# Altium schematic sheet Connector.SchDoc
size A4
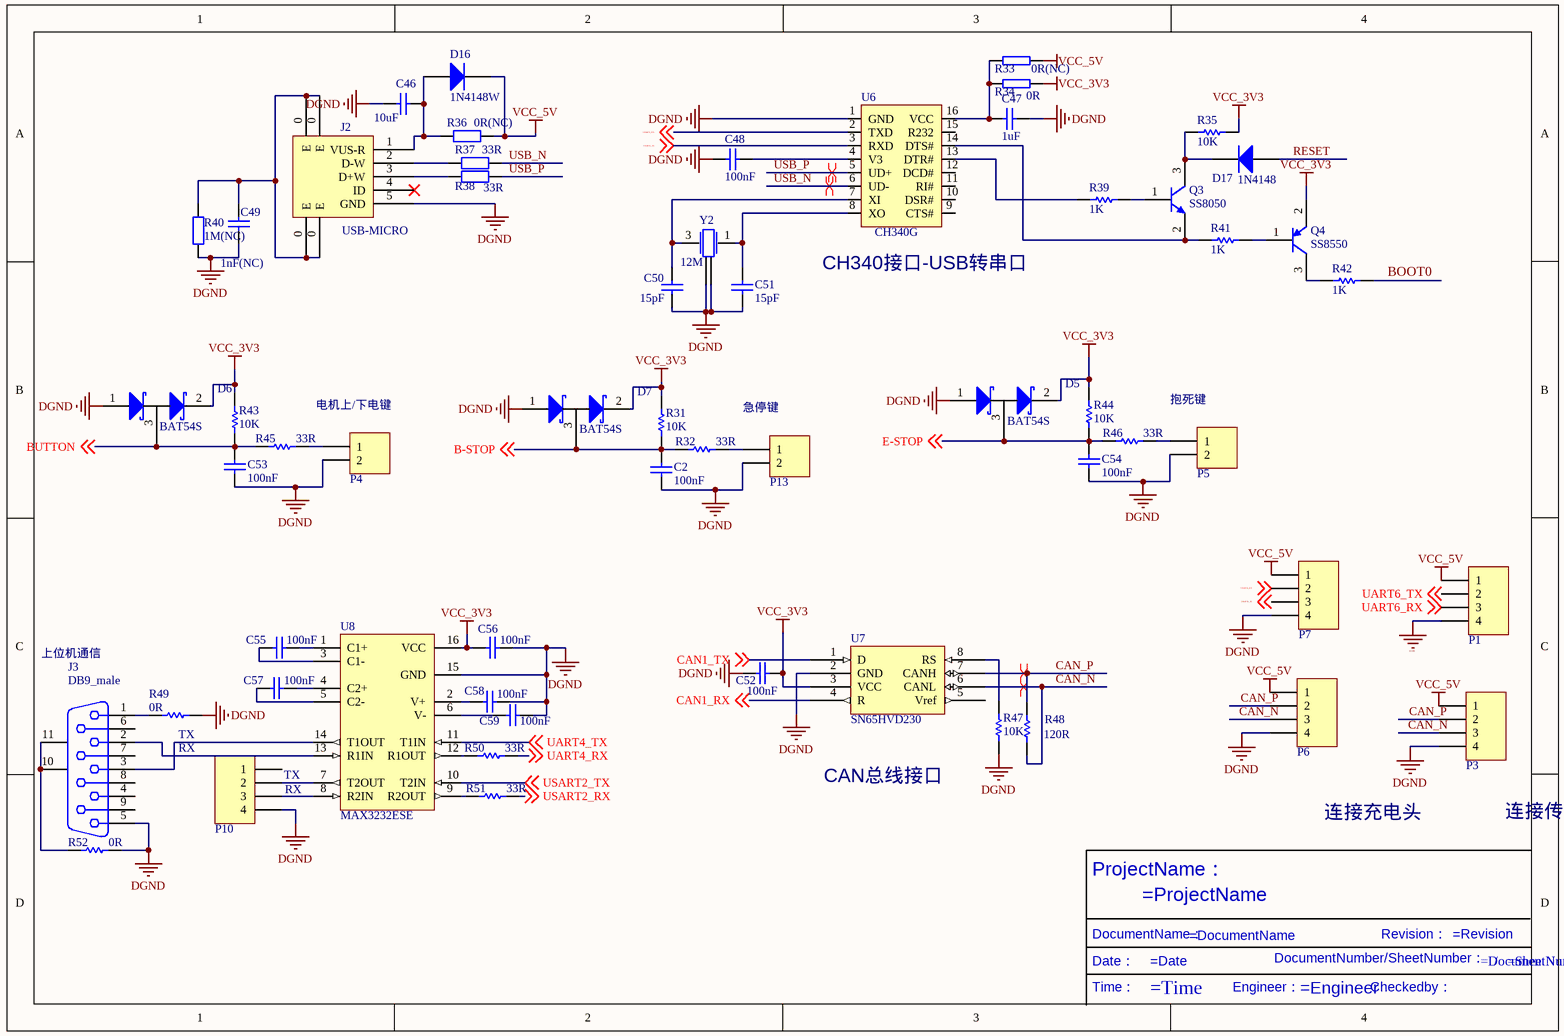
[diagram p0: Connector.SchDoc]

## Parts
C2  value 100nF  [C-RAD-0805]  (hidden comment: 100nF/±10%/50Vdc)
C46  value 10uF  [C-RAD-0805]  (hidden comment: 10uF/±10%/50Vdc)
C47  value 1uF  [C-RAD-0805]  (hidden comment: 1uF/±10%/50Vdc)
C48  value 100nF  [C-RAD-0805]  (hidden comment: 100nF/±10%/50Vdc)
C49  value 1nF(NC)  [C-RAD-0805]  (hidden comment: Cap)
C50  value 15pF  [C-RAD-0805]  (hidden comment: 15pF/±10%/50Vdc)
C51  value 15pF  [C-RAD-0805]  (hidden comment: 15pF/±10%/50Vdc)
C52  value 100nF  [C-RAD-0805]  (hidden comment: 100nF/±10%/50Vdc)
C53  value 100nF  [C-RAD-0805]  (hidden comment: 100nF/±10%/50Vdc)
C54  value 100nF  [C-RAD-0805]  (hidden comment: 100nF/±10%/50Vdc)
C55  value 100nF  [C-RAD-0805]  (hidden comment: 100nF/±10%/50Vdc)
C56  value 100nF  [C-RAD-0805]  (hidden comment: 100nF/±10%/50Vdc)
C57  value 100nF  [C-RAD-0805]  (hidden comment: 100nF/±10%/50Vdc)
C58  value 100nF  [C-RAD-0805]  (hidden comment: 100nF/±10%/50Vdc)
C59  value 100nF  [C-RAD-0805]  (hidden comment: 100nF/±10%/50Vdc)
D5  BAT54S  [SOT-23]
D6  BAT54S  [SOT-23]
D7  BAT54S  [SOT-23]
D16  1N4148W  [DIODE-1206]
D17  value 1N4148  [DIODE-1206]  (hidden comment: 1N4148W)
J2  USB-MICRO  [USB-MICRO-1]
J3  DB9_male  [DB9-M]
P1  Header 4  [SM04B-PBV]  (value not drawn)
P3  Header 4  [SM04B-PBV]  (value not drawn)
P4  Header 2  [MOLEX-2P]  (value not drawn)
P5  Header 2  [MOLEX-2P]  (value not drawn)
P6  Header 4  [SM04B-PBV]  (value not drawn)
P7  Header 4  [SM04B-PBV]  (value not drawn)
P10  Header 4  [SM04B-PBV]  (value not drawn)
P13  Header 2  [MOLEX-2P]  (value not drawn)
Q3  SS8050  [SOT-23]
Q4  SS8550  [SOT-23]
R31  value 10K  [0805-1]  (hidden comment: 10K 5% 1/16W 0805)
R32  value 33R  [0805-1]  (hidden comment: 33R 5% 1/16W 0805)
R33  value 0R(NC)  [0805-1]  (hidden comment: 0R 5% 1/16W 0805(NC))
R34  value 0R  [0805-1]  (hidden comment: 0R 5% 1/16W 0805)
R35  value 10K  [0805-1]  (hidden comment: 10K 5% 1/16W 0805)
R36  value 0R(NC)  [0805-1]  (hidden comment: 0R 5% 1/16W 0805(NC))
R37  value 33R  [0805-1]  (hidden comment: 33R 5% 1/16W 0805)
R38  value 33R  [0805-1]  (hidden comment: 33R 5% 1/16W 0805)
R39  value 1K  [0805-1]  (hidden comment: 1K 5% 1/16W 0805)
R40  value 1M(NC)  [0805-1]  (hidden comment: 1M 5% 1/16W 0805(NC))
R41  value 1K  [0805-1]  (hidden comment: 1K 5% 1/16W 0805)
R42  value 1K  [0805-1]  (hidden comment: 1K 5% 1/16W 0805)
R43  value 10K  [0805-1]  (hidden comment: 10K 5% 1/16W 0805)
R44  value 10K  [0805-1]  (hidden comment: 10K 5% 1/16W 0805)
R45  value 33R  [0805-1]  (hidden comment: 33R 5% 1/16W 0805)
R46  value 33R  [0805-1]  (hidden comment: 33R 5% 1/16W 0805)
R47  value 10K  [0805-1]  (hidden comment: 10K 5% 1/16W 0805)
R48  value 120R  [0805-1]  (hidden comment: 120R 5% 1/16W 0805)
R49  value 0R  [0805-1]  (hidden comment: 0R 5% 1/16W 0805)
R50  value 33R  [0805-1]  (hidden comment: 33R 5% 1/16W 0805)
R51  value 33R  [0805-1]  (hidden comment: 33R 5% 1/16W 0805)
R52  value 0R  [0805-1]  (hidden comment: 0R 5% 1/16W 0805)
U6  CH340G  [SOP16]
U7  SN65HVD230  [SO8-SN65HVD230]
U8  MAX3232ESE  [SOP16]
Y2  value 12M  [EPSON-16M]  (hidden comment: XTAL-12M)

## Nets
DGND: C2.2 C46.2 C47.2 C48.2 C49.2 C50.2 C51.2 C52.1 C53.2 C54.2 C56.1 C58.1 C59.1 D5.1(A) D6.1(A) D7.1(A) J2.5(GND) J3.5 P1.4 P3.4 P4.2 P5.2 P6.4 P7.4 P10.4 P13.2 R40.1 R47.2 R49.1 R52.1 U6.1(GND) U7.2(GND) U8.15(GND) Y2.2 Y2.4
VCC_3V3: C52.2 C56.2 D5.2(K) D6.2(K) D7.2(K) Q4.2(E) R31.2 R34.1 R35.1 R43.2 R44.2 U7.3(VCC) U8.16(VCC)
VCC_5V: D16.2(K) P1.1 P3.1 P6.1 P7.1 R33.1 R36.2
B-STOP: C2.1 D7.3(AK) R31.1 R32.2 ; off-sheet B-STOP
BOOT0: R42.2
BUTTON: C53.1 D6.3(AK) R43.1 R45.2 ; off-sheet BUTTON
CAN1_RX: U7.4(R) ; off-sheet CAN1_RX
CAN1_TX: U7.1(D) ; off-sheet CAN1_TX
CAN_N: P3.3 P6.3 R48.2 U7.6(CANL)
CAN_P: P3.2 P6.2 R48.1 U7.7(CANH)
E-STOP: C54.1 D5.3(AK) R44.1 R46.2 ; off-sheet E-STOP
RESET: D17.1(A)
UART4_RX: R50.2 ; off-sheet UART4_RX
UART4_TX: U8.11(T1IN) ; off-sheet UART4_TX
UART6_RX: P1.3 ; off-sheet UART6_RX
UART6_TX: P1.2 ; off-sheet UART6_TX
USART1_RX: U6.2(TXD) ; off-sheet USART1_RX
USART1_TX: U6.3(RXD) ; off-sheet USART1_TX
USART2_RX: R51.2 ; off-sheet USART2_RX
USART2_TX: U8.10(T2IN) ; off-sheet USART2_TX
USART3_RX: P7.2 ; off-sheet USART3_RX
USART3_TX: P7.3 ; off-sheet USART3_TX
USB_N: R37.2 U6.6(UD-)
USB_P: R38.2 U6.5(UD+)
NetC46_1: C46.1 D16.1(A) J2.1(VUS-R) R36.1
NetC47_1: C47.1 R33.2 R34.2 U6.16(VCC)
NetC48_1: C48.1 U6.4(V3)
NetC49_1: C49.1 J2.0(E) R40.2
NetC50_1: C50.1 U6.7(XI) Y2.3
NetC51_1: C51.1 U6.8(XO) Y2.1
NetC55_1: C55.1 U8.1(C1+)
NetC55_2: C55.2 U8.3(C1-)
NetC57_1: C57.1 U8.4(C2+)
NetC57_2: C57.2 U8.5(C2-)
NetC58_2: C58.2 U8.2(V+)
NetC59_2: C59.2 U8.6(V-)
NetD17_2: D17.2(K) Q3.3(C) R35.2
NetJ2_2: J2.2(D-W) R37.1
NetJ2_3: J2.3(D+W) R38.1
NetJ3_1: J3.1 R49.2
NetJ3_2: J3.2 U8.13(R1IN)
NetJ3_3: J3.3 U8.14(T1OUT)
NetJ3_10: J3.10(MH1) J3.11(MH2) R52.2
NetP4_1: P4.1 R45.1
NetP5_1: P5.1 R46.1
NetP10_2: P10.2 U8.7(T2OUT)
NetP10_3: P10.3 U8.8(R2IN)
NetP13_1: P13.1 R32.1
NetQ3_1: Q3.1(B) R39.1
NetQ3_2: Q3.2(E) R41.2 U6.14(DTS#)
NetQ4_1: Q4.1(B) R41.1
NetQ4_3: Q4.3(C) R42.1
NetR39_2: R39.2 U6.13(DTR#)
NetR47_1: R47.1 U7.8(RS)
NetR50_1: R50.1 U8.12(R1OUT)
NetR51_1: R51.1 U8.9(R2OUT)

Not connected (* = marked no-connect by the designer): J2 4(ID)*; J3 4 6 7 8 9; P10 1; U6 9(CTS#) 10(DSR#) 11(RI#) 12(DCD#) 15(R232); U7 5(Vref)

## Layout directives
differential pair: CAN_N, CAN_P, USB_N, USB_P

## Notes on the sheet
- (near U6) CH340接口-USB转串口
- 电机上/下电键
- 急停键
- 抱死键
- 上位机通信
- (near R49) TX
- (near R49) RX
- TX
- CAN总线接口
- RX
- 连接充电头
- 连接传感器
- Labels drawn without touching a wire or pin: /, =Date, =DocumentName, =DocumentNumber, =Engineer, =ProjectName, =Revision, =SheetNumber, =Time, Checkedby：, Date：, DocumentName：, DocumentNumber/SheetNumber：, Engineer：, ProjectName：, Revision：, Time：

## Library data of the parts
C2 C46-C59 = Cap: Capacitor; Published: 8-Jun-2000; LatestRevisionDate: 17-Jul-2002; LatestRevisionNote: Re-released for DXP Platform.; PackageReference: RAD-0.3; Publisher: Altium Limited; PackageDescription: Radial Cap, Thru-Hole; 2 Leads; 0.3 in Pin Spacing
D5-D7 = BAT54S: 双向肖特基二极管
D16 D17 = Diode: 二极管; Type: S01575; Published: 8-Jun-2000; LatestRevisionDate: 17-Jul-2002; LatestRevisionNote: Re-released for DXP Platform.; PackageDocument: Sep-1996; PackageReference: CD1206; Publisher: Altium Limited; Code_JEDEC: DO-214-AB
  D16: Value: 1N4148W
J3 = D Connector 9: 串口; PackageDocument: O; Positions: 9; Gender: Receptacle; Published: 15-Jun-2001; LatestRevisionDate: 17-Jul-2002; LatestRevisionNote: Re-released for DXP Platform.; DatasheetDocument: 1-Sep-1999; PackageReference: 788750; Publisher: Altium Limited; Orientation: Right Angle
P1 P3 P6 P7 P10 = Header 4: 接插件; LatestRevisionDate: 17-Jul-2002; LatestRevisionNote: Re-released for DXP Platform.; Publisher: Altium Limited
P4 P5 P13 = Header 2: 接插件; LatestRevisionDate: 17-Jul-2002; LatestRevisionNote: Re-released for DXP Platform.; Publisher: Altium Limited
Q3 = SS8050: NPN贴片三极管; Published: 8-Jun-2000; LatestRevisionDate: 15-Jan-2003; LatestRevisionNote: PCB Footprint 'BCY-W3/D4.7' replaced; DatasheetDocument: 1997; PackageDocument: Sep-1998; PackageReference: TO-92A; Publisher: Altium Limited; Code_JEDEC: TO-92A; ComponentLink1Description: Manufacturer Link; ComponentLink1URL: http://www.fairchildsemi.com/; ComponentLink2Description: Datasheet; ComponentLink2URL: http://www.fairchildsemi.com/ds/2N%2F2N3904.pdf
Q4 = SS8550: PNP贴片三极管; Published: 8-Jun-2000; LatestRevisionDate: 15-Jan-2003; LatestRevisionNote: PCB Footprint 'BCY-W3/D4.7' replaced; DatasheetDocument: 1997; PackageDocument: Sep-1998; PackageReference: TO-92A; Publisher: Altium Limited; Code_JEDEC: TO-92A; ComponentLink1Description: Manufacturer Link; ComponentLink1URL: http://www.fairchildsemi.com/; ComponentLink2Description: Datasheet; ComponentLink2URL: http://www.fairchildsemi.com/ds/2N%2F2N3906.pdf
R31 R32 R35 R39 R41-R52 = Res1: Resistor; Published: 8-Jun-2000; LatestRevisionDate: 17-Jul-2002; LatestRevisionNote: Re-released for DXP Platform.; PackageReference: AXIAL-0.3; Publisher: Altium Limited; PackageDescription: Axial Device, Thru-Hole; 2 Leads; 0.3 in Pin Spacing
R33 R34 = RES
R36-R38 R40 = Res1: 贴片电阻; Published: 8-Jun-2000; LatestRevisionDate: 17-Jul-2002; LatestRevisionNote: Re-released for DXP Platform.; PackageReference: AXIAL-0.4; Publisher: Altium Limited; Part No: *
U6 = CH340G: 串口转USB芯片
U7 = SN65HVD230D
U8 = MAX3232ESE: +5V Powered, Multi-Channel RS-232 Driver/Receiver; Published: 16-Jan-2001; LatestRevisionDate: 29-May-2009; LatestRevisionNote: Component Body Added.; PackageVersion: 1997; PackageReference: PE16A; Publisher: Altium Limited; PackageDescription: DIP, 16-Pin, Row Spacing 7.62 mm, Pitch 2.54 mm; Code_JEDEC: MS-001-BB; ComponentLink1Description: Manufacturer Link; ComponentLink1URL: http://www.maxim-ic.com/; ComponentLink2Description: Datasheet; ComponentLink2URL: http://pdfserv.maxim-ic.com/en/ds/MAX220-MAX249.pdf
Y2 = XTAL-4PIN: 晶振